# EAGLE design transistor_low_side (EAGLE 5.11)
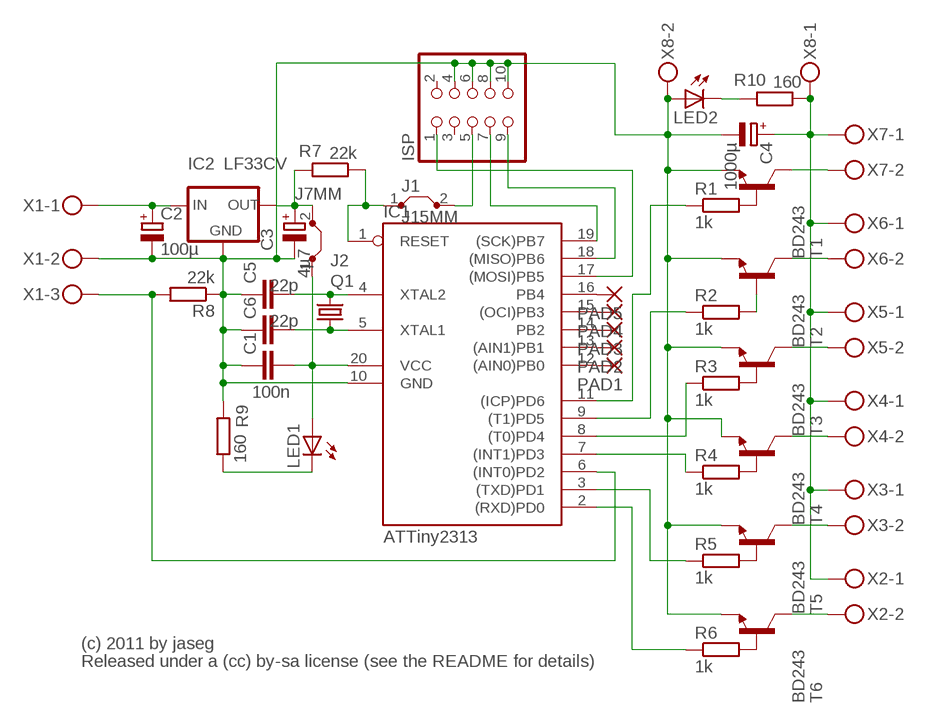
[diagram p0: schematic, sheet 1]

## Parts
C1  100n  C-EUC1206  [C1206]
C2  100µ  CPOL-EUE3.5-8  [E3,5-8]
C3  4µ7  CPOL-EUE2-5  [E2-5]
C4  1000µ  CPOL-EUE5-13  [E5-13]
C5  22p  C-EUC1206  [C1206]
C6  22p  C-EUC1206  [C1206]
IC1  ATTiny2313  AT90S2313S  [SO20L]
IC2  LF33CV  78XXS  [78XXS]
ISP  PINHD-2X5  [2X05]
J1  J15MM  [15]
J2  J7MM  [07]
LED1  LEDCHIPLED_1206  [CHIPLED_1206]
LED2  LEDCHIPLED_1206  [CHIPLED_1206]
PAD1  SMD2  [SMD1,27-2,54]
PAD2  SMD2  [SMD1,27-2,54]
PAD3  SMD2  [SMD1,27-2,54]
PAD4  SMD2  [SMD1,27-2,54]
PAD5  SMD2  [SMD1,27-2,54]
Q1  CSM-7X-DU  [CSM-7X-DU]
R1  1k  R-EU_M1206  [M1206]
R2  1k  R-EU_M1206  [M1206]
R3  1k  R-EU_M1206  [M1206]
R4  1k  R-EU_M1206  [M1206]
R5  1k  R-EU_M1206  [M1206]
R6  1k  R-EU_M1206  [M1206]
R7  22k  R-EU_M1206  [M1206]
R8  22k  R-EU_M1206  [M1206]
R9  160  R-EU_M1206  [M1206]
R10  160  R-EU_M1206  [M1206]
T1  BD243  [TO220]
T2  BD243  [TO220]
T3  BD243  [TO220]
T4  BD243  [TO220]
T5  BD243  [TO220]
T6  BD243  [TO220]
X1  MKDSN1,5/3-5,08  [MKDSN1,5/3-5,08]
X2  MKDSN1,5/2-5,08  [MKDSN1,5/2-5,08]
X3  MKDSN1,5/2-5,08  [MKDSN1,5/2-5,08]
X4  MKDSN1,5/2-5,08  [MKDSN1,5/2-5,08]
X5  MKDSN1,5/2-5,08  [MKDSN1,5/2-5,08]
X6  MKDSN1,5/2-5,08  [MKDSN1,5/2-5,08]
X7  MKDSN1,5/2-5,08  [MKDSN1,5/2-5,08]
X8  MKDSN1,5/2-5,08  [MKDSN1,5/2-5,08]

## Nets
GND: C1.1 C2.- C3.- C4.- C5.1 C6.1 IC1.10(GND) IC2.GND ISP.4 ISP.6 ISP.8 ISP.10 LED2.A R8.1 R9.2 T1.3(E) T2.3(E) T3.3(E) T4.3(E) T5.3(E) T6.3(E) X1.2 X8.2
N$1: R1.2 T1.1(B)
N$2: R2.2 T2.1(B)
N$3: R3.2 T3.1(B)
N$4: R4.2 T4.1(B)
N$5: R5.2 T5.1(B)
N$6: R6.2 T6.1(B)
N$7: IC1.2((RXD)PD0) R6.1
N$8: IC1.3((TXD)PD1) R5.1
N$9: IC1.7((INT1)PD3) R4.1
N$10: IC1.11((ICP)PD6) R1.1
N$11: IC1.9((T1)PD5) R2.1
N$12: IC1.8((T0)PD4) R3.1
N$13: ISP.5 J1.2
N$14: C3.+ IC2.OUT J2.2 R7.2
N$15: C2.+ IC2.IN X1.1
N$16: C1.2 IC1.20(VCC) J2.1 LED1.A
N$17: C5.2 IC1.4(XTAL2) Q1.2
N$18: C6.2 IC1.5(XTAL1) Q1.1
N$19: IC1.1(RESET) J1.1 R7.1
N$20: IC1.17((MOSI)PB5) ISP.1
N$21: IC1.19((SCK)PB7) ISP.7
N$22: IC1.18((MISO)PB6) ISP.9
N$23: IC1.12((AIN0)PB0) PAD1.1(P)
N$24: C4.+ R10.1 X2.1 X3.1 X4.1 X5.1 X6.1 X7.1 X8.1
N$25: T1.2(C) X7.2
N$26: IC1.6((INT0)PD2) R8.2 X1.3
N$27: T6.2(C) X2.2
N$28: T2.2(C) X6.2
N$29: T3.2(C) X5.2
N$30: T4.2(C) X4.2
N$31: T5.2(C) X3.2
N$32: IC1.13((AIN1)PB1) PAD2.1(P)
N$33: IC1.14(PB2) PAD3.1(P)
N$34: IC1.15((OCI)PB3) PAD4.1(P)
N$35: IC1.16(PB4) PAD5.1(P)
N$36: LED1.C R9.1
N$37: LED2.C R10.2
Unconnected: ISP.2 ISP.3

## Notes on the sheet
- (c) 2011 by jaseg
- Released under a (cc) by-sa license (see the README for details)

## Library data of the parts
C1 C5 C6 = rcl:C-EU: CAPACITOR, European symbol
C2-C4 = rcl:CPOL-EU: POLARIZED CAPACITOR, European symbol
IC1 = atmel:AT90S2313: MICROCONTROLLER 2 Kbytes FLASH 128 bytes SRAM 128 bytes EEPROM UART; OC_FARNELL: unknown; OC_NEWARK: unknown
IC2 = v-reg:78XXS: VOLTAGE REGULATOR
ISP = pinhead:PINHD-2X5: PIN HEADER
J1 J2 = jumper:J: Bridge
LED1 LED2 = led:LED: LED OSRAM: - CHIPLED LG R971, LG N971, LY N971, LG Q971, LY Q971, LO R971, LY R971 LH N974, LH R974 LS Q976, LO Q976, LY Q976 LO Q996 - Hyper CHIPLED LW Q18S LB Q993, LB Q99A, LB R99A - SideLED LS A670, LO A670, LY A670, LG A670, LP A670 LB A673, LV A673, LT A673, LW A673 LH A674 LY A675 LS A676, LA A676, LO A676, LY A676, LW A676 LS A679, LY A679, LG A679 - Hyper Micro SIDELED® LS Y876, LA Y876, LO Y876, LY Y876 LT Y87S - SmartLED LW L88C, LW L88S LB L89C, LB L89S, LG L890 LS L89K, LO L89K, LY L89K LS L896, LA L896, LO L896, LY L896 - TOPLED LS T670, LO T670, LY T670, LG T670, LP T670 LSG T670, LSP T670, LSY T670, LOP T670, LYG T670 LG T671, LOG T671, LSG T671 LB T673, LV T673, LT T673, LW T673 LH T674 LS T676, LA T676, LO T676, LY T676, LB T676, LH T676, LSB T676, LW T676 LB T67C, LV T67C, LT T67C, LS T67K, LO T67K, LY T67K, LW E67C LS E67B, LA E67B, LO E67B, LY E67B, LB E67C, LV E67C, LT E67C LW T67C LS T679, LY T679, LG T679 LS T770, LO T770, LY T770, LG T770, LP T770 LB T773, LV T773, LT T773, LW T773 LH T774 LS E675, LA E675, LY E675, LS T675 LS T776, LA T776, LO T776, LY T776, LB T776 LHGB T686 LT T68C, LB T68C - Hyper Mini TOPLED® LB M676 - Mini TOPLED Santana® LG M470 LS M47K, LO M47K, LY M47K Source: http://www.osram.convergy.de LUXEON: - LUMILED® LXK2-PW12-R00, LXK2-PW12-S00, LXK2-PW14-U00, LXK2-PW14-V00 LXK2-PM12-R00, LXK2-PM12-S00, LXK2-PM14-U00 LXK2-PE12-Q00, LXK2-PE12-R00, LXK2-PE12-S00, LXK2-PE14-T00, LXK2-PE14-U00 LXK2-PB12-K00, LXK2-PB12-L00, LXK2-PB12-M00, LXK2-PB14-N00, LXK2-PB14-P00, LXK2-PB14-Q00 LXK2-PR12-L00, LXK2-PR12-M00, LXK2-PR14-Q00, LXK2-PR14-R00 LXK2-PD12-Q00, LXK2-PD12-R00, LXK2-PD12-S00 LXK2-PH12-R00, LXK2-PH12-S00 LXK2-PL12-P00, LXK2-PL12-Q00, LXK2-PL12-R00 Source: www.luxeon.com KINGBRIGHT: KA-3528ASYC Source: www.kingbright.com
PAD1-PAD5 = wirepad:SMD2: SMD PAD
Q1 = crystal:CSM-7X-DU: SMD CRYSTAL Source: www.ecsxtal.com .. Crystal 3.6864MHz CSM_7X_DU.PDF; OC_FARNELL: unknown; OC_NEWARK: unknown
R1-R10 = rcl:R-EU_: RESISTOR, European symbol
T1-T6 = transistor:BD243: NPN TRANSISTOR Source: Motorola Semiconductor, Master Selection Guide Q3/95 SG73 REV 8 page 5.5-4
X1 = con-phoenix-508:MKDSN1,5/3-5,08: MKDSN 1,5/ 3-5,08 Printklemme Nennstrom: 13,5 A Nennspannung: 250 V Rastermaß: 5,08 mm Polzahl: 3 Anschlussart: Schraubanschluss Montage: Löten Anschlussrichtung Leiter/Platine: 0 ° Artikelnummer: 1729131 Source: http://eshop.phoenixcontact.com .. 1729131.pdf; MPN: SMKDSN1,5/3-5,08; OC_FARNELL: 1792904; OC_NEWARK: 70R0299
X2-X8 = con-phoenix-508:MKDSN1,5/2-5,08: MKDSN 1,5/ 2-5,08 Printklemme Nennstrom: 13,5 A Nennspannung: 250 V Rastermaß: 5,08 mm Polzahl: 2 Anschlussart: Schraubanschluss Montage: Löten Anschlussrichtung Leiter/Platine: 0 ° Artikelnummer: 1729128 Source: http://eshop.phoenixcontact.com .. 1729128.pdf; MPN: MKDSN 1,5/2-5.08; OC_FARNELL: 1792903; OC_NEWARK: 30M2397

## Board
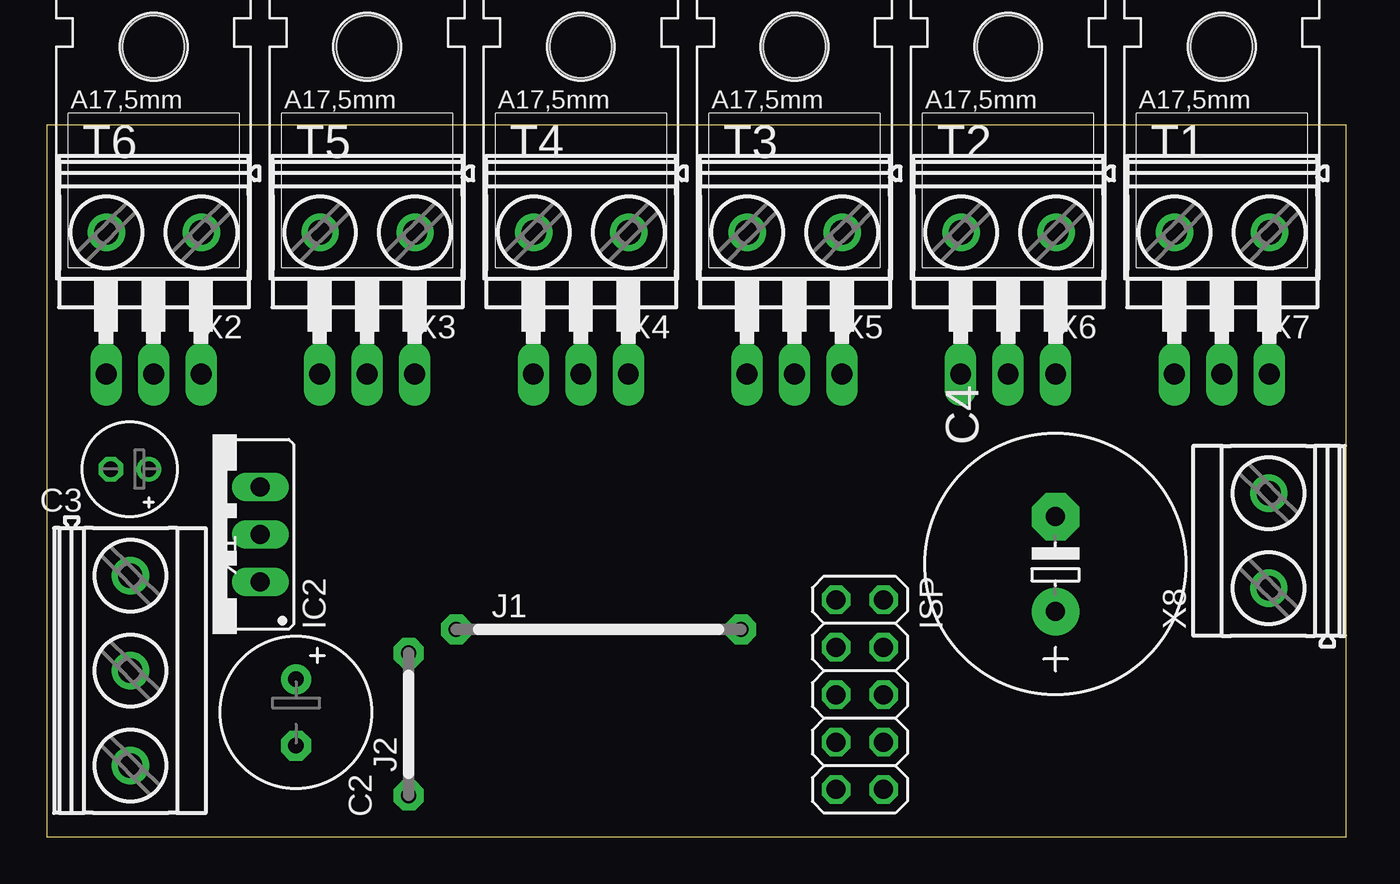
[diagram p1: board, top side]
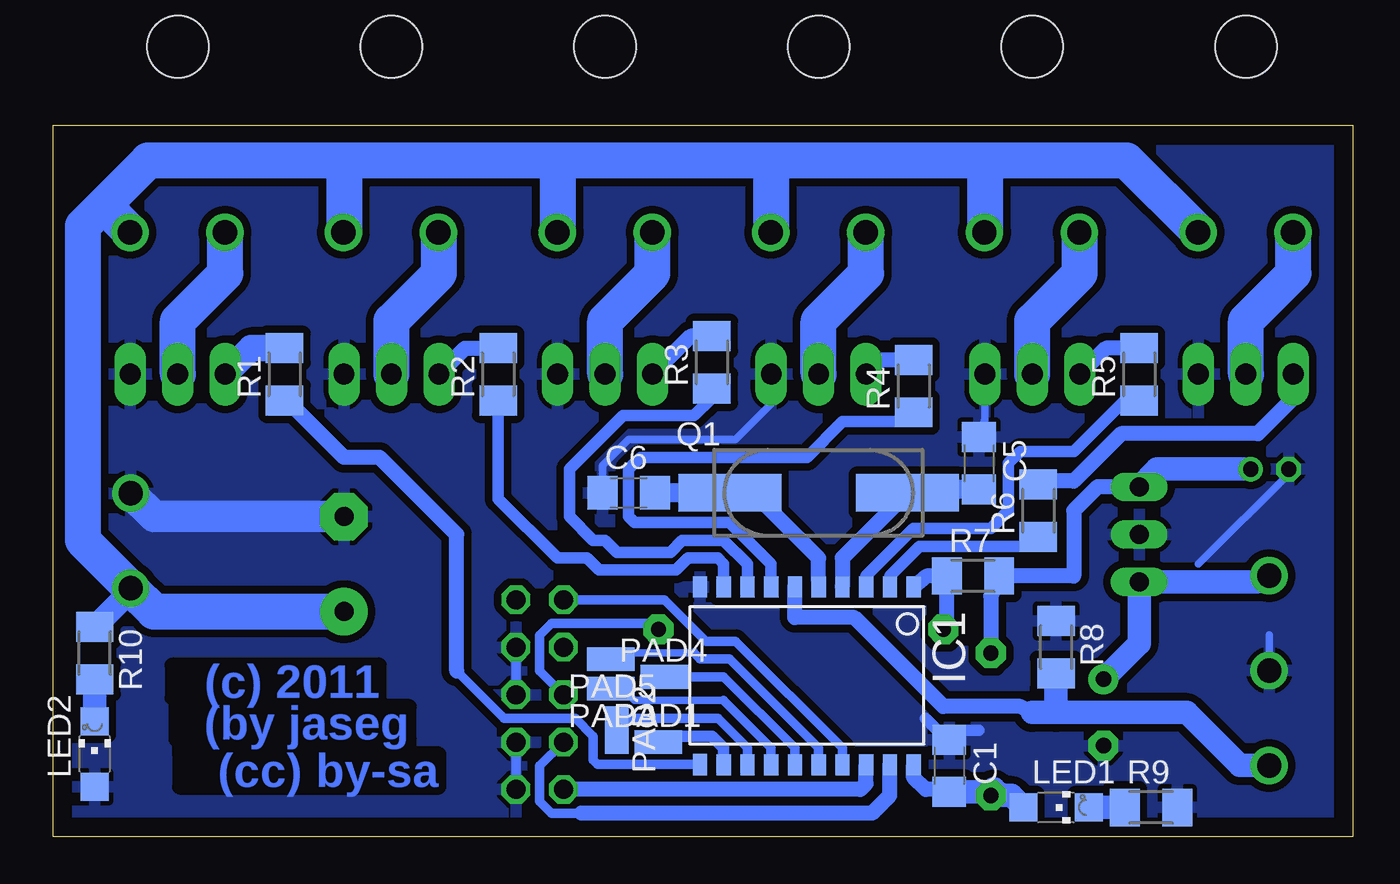
[diagram p2: board, bottom side, seen from below]

Size 69.52 x 38.09 mm. Coordinates in mm from the lower left corner, seen from the top.
Outline: 0,0 69.52,0 69.52,38.09 0,38.09 0,0
Copper layers (1*16): Top 0.035mm / dielectric 1.5mm / Bottom 0.035mm
Design rules "default": minimum track width 10mil, minimum drill 24mil, track to track 8mil, track to pad 8mil, pad to pad 8mil, via to via 8mil, smd to smd 8mil, copper to edge 40mil, drill to drill 8mil, minimum pad ring 10mil, minimum via ring 8mil, stop-mask expansion 4mil, vias tented up to drill 0mil, thermal gap 10mil

### Footprints (pad centres in the part's own frame; a part is rotated, then mirrored left to right if it is on the bottom)
C1206 = smd 1.6 x 1.8: 1 -1.4,0; 2 1.4,0
E3,5-8 = drill 0.813 pad 1.6 round: + -1.778,0 | drill 0.813 pad 1.6 octagon: - 1.778,0
E2-5 = drill 0.813 pad 1.27 round: + -1.016,0 | drill 0.813 pad 1.27 octagon: - 1.016,0
E5-13 = drill 1.016 pad 2.54 round: + -2.54,0 | drill 1.016 pad 2.54 octagon: - 2.54,0
SO20L = smd 0.762 x 1.143: 1 -5.08,-5.131; 2 -3.81,-5.131; 3 -2.54,-5.131; 4 -1.27,-5.131; 5 0,-5.131; 6 1.27,-5.131; 7 2.54,-5.131; 8 3.81,-5.131; 9 5.08,-5.131; 10 6.35,-5.131; 11 6.35,4.369; 12 5.08,4.394; 13 3.81,4.394; 14 2.54,4.394; 15 1.27,4.394; 16 0,4.394; 17 -1.27,4.394; 18 -2.54,4.394; 19 -3.81,4.394; 20 -5.08,4.394
78XXS = drill 1.016 long: GND 0,-2.54; IN -2.54,-2.54; OUT 2.54,-2.54
2X05 = drill 1.016 octagon: 1 -5.08,-1.27; 2 -5.08,1.27; 3 -2.54,-1.27; 4 -2.54,1.27; 5 0,-1.27; 6 0,1.27; 7 2.54,-1.27; 8 2.54,1.27; 9 5.08,-1.27; 10 5.08,1.27
15 = drill 0.813 pad 1.6 octagon: 1 -7.62,0; 2 7.62,0
07 = drill 0.813 pad 1.6 octagon: 1 -3.81,0; 2 3.81,0
CHIPLED_1206 = smd 1.5 x 1.5: A 0,-1.75; C 0,1.75
SMD1,27-2,54 = smd 1.27 x 2.54: 1 0,0
CSM-7X-DU = smd 5.5 x 2: 1 -4.75,0; 2 4.75,0
M1206 = smd 1.6 x 2: 1 -1.4,0; 2 1.4,0
TO220 = drill 1.118 long: 1 -2.54,-6.35; 2 0,-6.35; 3 2.54,-6.35 | hole 3.302: 0,11.176
MKDSN1,5/3-5,08 = drill 1.3 pad 2 round: 1 -7.641,0.025; 2 -2.561,0.025; 3 2.519,0.025
MKDSN1,5/2-5,08 = drill 1.3 pad 2 round: 1 -2.561,0.025; 2 2.519,0.025

### Placement (x,y rotation side)
C1  21.59,3.81 270 bottom
C2  13.34,6.67 270 top
C3  4.45,19.68 180 top
C4  53.98,14.6 90 top
C5  20,20 270 bottom
C6  38.73,18.41 0 bottom
IC1  28.58,8.25 180 bottom
IC2  8.89,16.19 90 top
ISP  43.5,7.62 270 top
J1  29.53,11.11 0 top
J2  19.37,6.03 90 top
LED1  15.88,1.59 270 bottom
LED2  67.31,4.45 0 bottom
PAD1  37.15,5.08 270 bottom
PAD2  39.37,5.71 180 bottom
PAD3  39.69,7.94 90 bottom
PAD4  36.83,8.57 270 bottom
PAD5  39.69,9.52 90 bottom
Q1  28.58,18.41 0 bottom
R1  57.15,24.77 90 bottom
R2  45.72,24.77 90 bottom
R3  34.29,25.4 90 bottom
R4  23.49,24.13 90 bottom
R5  11.43,24.77 90 bottom
R6  16.83,17.46 90 bottom
R7  20.32,13.97 0 bottom
R8  15.88,10.16 270 bottom
R9  10.8,1.59 0 bottom
R10  67.31,9.84 270 bottom
T1  62.87,31.11 0 top
T2  51.43,31.11 0 top
T3  40.01,31.11 0 top
T4  28.58,31.11 0 top
T5  17.15,31.11 0 top
T6  5.71,31.11 0 top
X1  4.45,6.35 270 top
X2  5.71,32.39 180 top
X3  17.15,32.39 180 top
X4  28.58,32.39 180 top
X5  40.01,32.39 180 top
X6  51.43,32.39 180 top
X7  62.87,32.39 180 top
X8  65.41,15.88 90 top

### Tracks (layer width: path | path; a pad name or v marks a point on that pad's centre or on a via)
GND
  Bottom 0.406: X1.2 4.47,10.82 | C3.- 3.43,19.43 8.26,14.6 | IC1.10 35.05,13.52 | C6.1 40.13,19.87 38.73,21.27 33.02,21.27 31.12,23.18 T4.3 | C5.1 19.69,22.36 T5.3
  Bottom 0.508: ISP.10 ISP.8 | ISP.6 ISP.4
  Bottom 0.61: 22.86,6.35 22.23,5.71 20,5.71
  Bottom 1.676: C4.- 64.13,17.14 X8.2
  pour Bottom (isolate 0.406): 0,1.27 69.85,1.27 69.85,36.83 0,36.83
N$1
  Bottom 1.422: T1.1 58.93,26.16 R1.2
N$2
  Bottom 0.813: T2.1 47.49,26.16 R2.2
N$3
  Bottom 0.813: T3.1 35.43,26.8 R3.2
N$4
  Bottom 0.813: T4.1 25.27,25.53 R4.2
N$5
  Bottom 0.813: T5.1 13.21,26.16 R5.2
N$6
  Bottom 0.813: R6.2 16.64,19.05 14.92,19.05 12.38,21.59 5.08,21.59 3.18,23.5 T6.1
N$7
  Bottom 0.406: R6.1 17.27,15.74
  Bottom 0.61: IC1.2 24.77,13.97 23.18,15.56 17.46,15.56 17.27,15.74
N$8
  Bottom 0.406: R5.1 12.07,23.5
  Bottom 0.61: IC1.3 26.04,13.97 23.49,16.51 19.37,16.51 18.41,17.46 18.41,20 17.78,20.64 14.92,20.64 12.07,23.5
N$9
  Bottom 0.61: IC1.7 31.12,14.6 33.34,16.83 38.42,16.83 38.73,17.14 38.73,19.68 38.1,20.32 29.21,20.32 27.3,22.22 24.13,22.22 R4.1
N$10
  Bottom 0.406: 57.02,23.36 R1.1
  Bottom 0.508: 47.94,8.89 45.4,6.35 41.59,6.35 40.64,5.4 40.64,4.13 40.4,3.89 IC1.11
  Bottom 0.813: 57.02,23.36 53.98,20.32 52.07,20.32 47.94,16.19 47.94,8.89
N$11
  Bottom 0.61: IC1.9 33.66,14.6 33.97,14.92 35.56,14.92 36.2,14.29 40.32,14.29 40.96,14.92 42.55,14.92 45.72,18.1 R2.1
N$12
  Bottom 0.406: 34.29,23.5 R3.1
  Bottom 0.61: IC1.8 32.38,14.6 33.66,15.88 35.88,15.88 36.51,15.24 39.37,15.24 40.01,15.88 40.64,15.88 41.91,17.14 41.91,19.68 39.05,22.54 35.24,22.54 34.29,23.5
N$13
  Bottom 0.508: J1.2 37.47,11.43 42.86,11.43 43.5,10.8 43.5,8.89 ISP.5
N$14
  Bottom 0.813: J2.2 19.37,12.89 R7.2 14.92,13.97 14.92,17.46 13.65,18.73 IC2.OUT
  Bottom 1.27: C3.+ 10.48,19.68 IC2.OUT
N$15
  Bottom 0.406: X1.1 5.13,13.65
  Bottom 1.27: 5.13,13.65 IC2.IN 11.43,10.35 C2.+
N$16
  Bottom 0.406: C1.2 21.72,2.54
  Bottom 0.813: IC1.20 23.49,3.17 22.86,2.54 21.72,2.54 | J2.1 19.05,2.41
  Bottom 1.27: C1.2 19.05,2.41 19.21,2.57 | LED1.A 18.26,2.22 J2.1
N$17
  Bottom 0.813: IC1.4 27.3,14.93 Q1.2 23.64,18.6
  Bottom 1.016: C5.2 23.64,18.6
N$18
  Bottom 0.406: IC1.5 28.58,13.66 | 33.45,18.28 Q1.1 33.97,18.41
  Bottom 0.61: 32.07,18.41 33.97,18.41
  Bottom 0.813: 28.58,13.66 28.58,14.92 32.07,18.41
  Bottom 1.016: 33.97,18.41 C6.2
N$19
  Bottom 0.406: R7.1 21.59,13.34
  Bottom 0.813: IC1.1 22.81,13.97 R7.1 21.72,11.56 J1.1
N$20
  Bottom 0.508: IC1.17 27.3,4.76 33.02,10.48 34.61,10.48 36.83,12.7 ISP.1
N$21
  Bottom 0.508: 41.27,1.27 42.86,1.27 43.5,1.91 43.5,3.81 ISP.7
  Bottom 0.813: IC1.19 24.77,2.22 25.72,1.27 41.27,1.27
N$22
  Bottom 0.813: IC1.18 26.04,2.86 26.35,2.54 ISP.9
N$23
  Bottom 0.61: IC1.12 33.66,4.76 34.29,5.4 36.83,5.4 PAD1.1
N$24
  Bottom 0.406: X8.1 | X7.1 | 53.98,32.38 X6.1 | 42.55,32.38 X5.1 | 31.12,32.38 X4.1 | 19.69,32.38 X3.1
  Bottom 1.27: R10.1 65.72,12.83 65.72,13.02 65.43,13.31 X8.1
  Bottom 1.93: C4.+ 64.13,12.06 X8.1 | X8.1 67.94,15.88 67.94,32.7 66.83,33.81 | X2.1 12.11,36.19 19.69,36.19 | 19.69,36.19 31.12,36.19 | 31.12,36.19 42.55,36.19 | 42.55,36.19 53.98,36.19 | 53.98,36.19 53.98,32.38 | 42.55,36.19 42.55,32.38 | 31.12,36.19 31.12,32.38 | 19.69,36.19 19.69,32.38 | 53.98,36.19 64.45,36.19 66.83,33.81 | X7.1 65.43,32.41 66.83,33.81
N$25
  Bottom 1.93: T1.2 62.87,27.62 60.32,30.16 60.32,32.34 X7.2
N$26
  Bottom 0.813: 17.15,6.67 17.78,6.98 21.91,6.98 26.67,11.75 29.84,11.75 IC1.6
  Bottom 1.27: X1.3 6.05,3.83 8.89,6.67 15.88,6.67 | 15.88,6.67 17.15,6.67 | 15.88,6.67 R8.2
N$27
  Bottom 1.93: T6.2 5.71,27.62 3.18,30.16 3.18,32.34 X2.2
N$28
  Bottom 1.93: T2.2 51.43,27.62 48.9,30.16 48.9,32.34 X6.2
N$29
  Bottom 1.93: T3.2 40.01,27.62 37.47,30.16 37.47,32.34 X5.2
N$30
  Bottom 1.93: T4.2 28.58,27.62 26.04,30.16 26.04,32.34 X4.2
N$31
  Bottom 1.93: T5.2 17.15,27.62 14.61,30.16 14.61,32.34 X3.2
N$32
  Bottom 0.508: IC1.13 32.38,4.76 33.97,6.35 38.73,6.35 PAD2.1
N$33
  Bottom 0.406: 33.66,7.3 38.42,7.3 38.73,7.62
  Bottom 0.508: IC1.14 31.12,4.76 33.66,7.3 | 38.73,7.62 39.37,7.62 PAD3.1
N$34
  Bottom 0.508: IC1.15 29.84,4.76 33.66,8.57 PAD4.1
N$35
  Bottom 0.406: 35.24,9.84 39.37,9.84
  Bottom 0.508: IC1.16 28.58,4.76 33.34,9.52 34.93,9.52 35.24,9.84 | 39.37,9.84 PAD5.1
N$36
  Bottom 1.27: R9.1 LED1.C
N$37
  Bottom 1.27: LED2.C R10.2

### Text on the board
Bottom: (c) 2011 | (by jaseg | (cc) by-sa